# Altium schematic sheet accero_humid_rtc.SchDoc: OPO
size Letter; Author: Kuo, Huang; Revision: 4.0; SheetNumber: 1; SheetTotal: 7
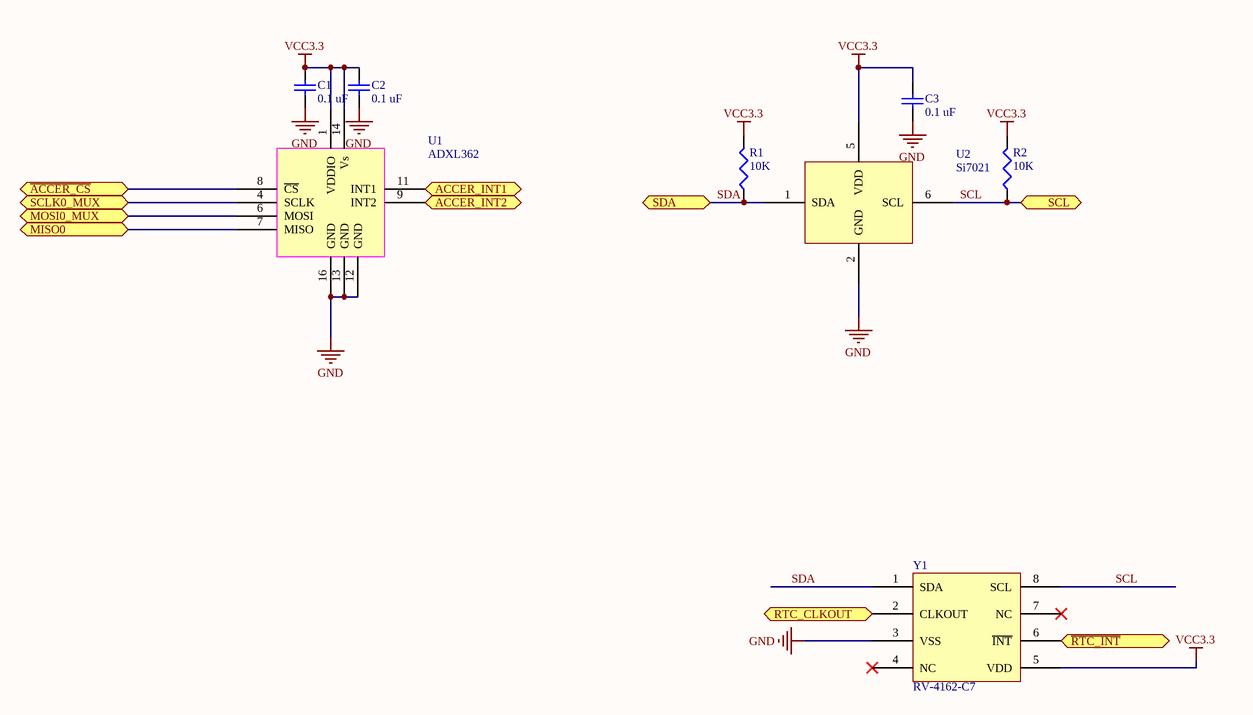
[diagram p0: accero_humid_rtc.SchDoc]

## Parts
C1  value 0.1 uF  [0402]  (hidden comment: Ceramic capacitor)
C2  value 0.1 uF  [0402]  (hidden comment: Ceramic capacitor)
C3  value 0.1 uF  [0402]  (hidden comment: Ceramic capacitor)
R1  value 10K  [0402]  (hidden comment: Chip resistor)
R2  value 10K  [0402]  (hidden comment: Chip resistor)
U1  ADXL362  [LGA_CC-16-4]
U2  Si7021  [DFN6-Si7021]
Y1  RV-4162-C7  [RV4162]

## Ports
ACCER_INT1, ACCER_INT2, MISO0, MOSI0_MUX, RTC_CLKOUT, SCL, SCLK0_MUX, SDA, ~{ACCER_CS}, ~{RTC_INT}

## Nets
GND: C1.2 C2.2 C3.2 U1.12(GND) U1.13(GND) U1.16(GND) U2.2(GND) Y1.3(VSS)
VCC3.3: C1.1 C2.1 C3.1 R1.1 R2.1 U1.1(VDDIO) U1.14(Vs) U2.5(VDD) Y1.5(VDD)
~{ACCER_CS}: U1.8(~{CS}) ; port ~{ACCER_CS}
ACCER_INT1: U1.11(INT1) ; port ACCER_INT1
ACCER_INT2: U1.9(INT2) ; port ACCER_INT2
MISO0: U1.7(MISO) ; port MISO0
MOSI0_MUX: U1.6(MOSI) ; port MOSI0_MUX
~{RTC_INT}: Y1.6(~{INT}) ; port ~{RTC_INT}
RTC_CLKOUT: Y1.2(CLKOUT) ; port RTC_CLKOUT
SCL: R2.2 U2.6(SCL) Y1.8(SCL) ; port SCL
SCLK0_MUX: U1.4(SCLK) ; port SCLK0_MUX
SDA: R1.2 U2.1(SDA) Y1.1(SDA) ; port SDA

Not connected (* = marked no-connect by the designer): U2 3(DNC) 4(DNC) 7(DNC); Y1 4(NC)* 7(NC)*

## Notes on the sheet
- Title
- Date:
- Author:
- Revision:
- Sheet
- of
- University of Michigan
- File:

## Library data of the parts
C1-C3 = C_0.1u_0402_ceramic: Ceramic capacitor, 0.1u, 0402 package; Manufacture: TDK; voltage rated: 10 V; tolerance: 10%; Supplier 1: Digi-Key; Supplier Part Number 1: 445-1265-1-ND; package: 0402
R1 R2 = R_10K_0402: Chip resistor, 10K, 0402 package; tolerance: 1%; power: 1/16 W; Supplier 1: Digi-Key; Supplier Part Number 1: 541-10.0KLDKR-ND; package: 0402
U1 = ADXL362: Micropower, 3-Axis, ±2 g/±4 g/±8 g  Digital Output MEMS Accelerometer; Supplier 1: Digi-Key; Supplier Part Number 1: ADXL362BCCZ-RL7CT-ND
U2 = Si7021: Temperature and Humidity Sensor; Supplier 1: Digikey; Supplier Part Number 1: 336-2542-1-ND
Y1 = RV-4162-C7: Real Time Clock Module with I2C Bus; Supplier 1: Newark; Supplier Part Number 1: 09X0517